# EAGLE design rpi_gnss_board (EAGLE 9.6.2)
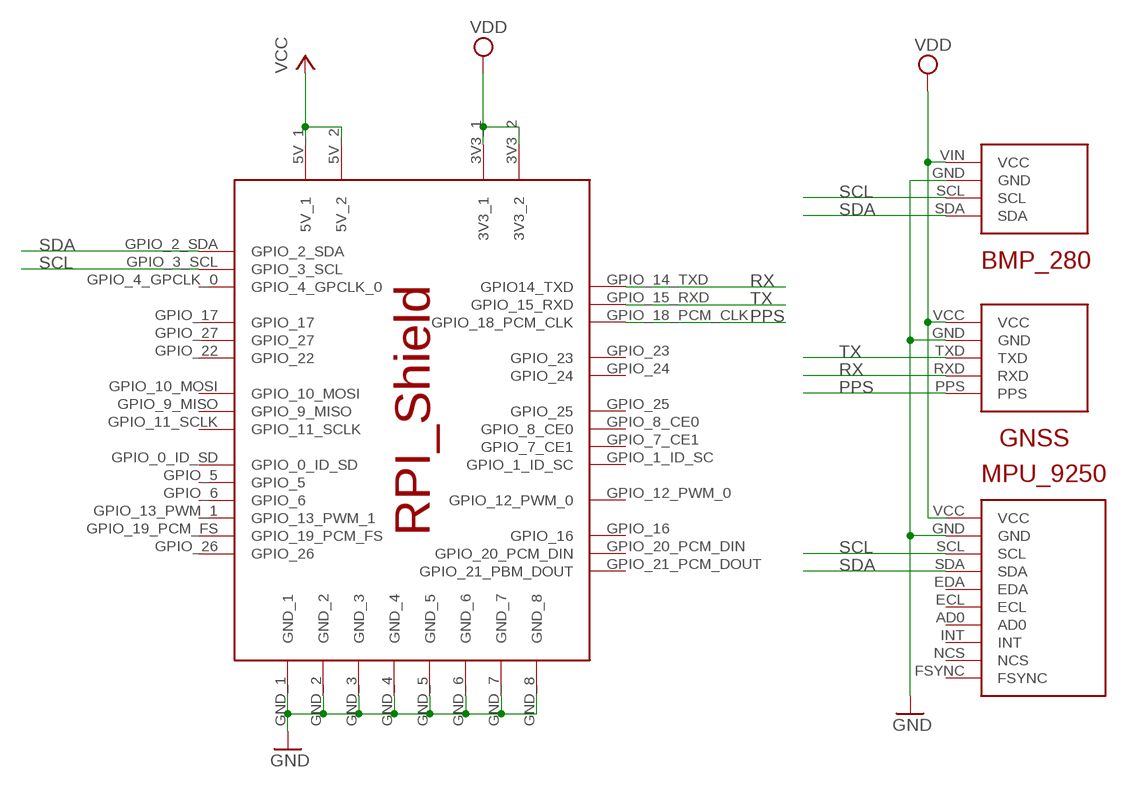
[diagram p0: schematic, sheet 1]

## Parts
U$1  RPI_SHIELD  [RPI_SHIELD]
U$2  BMP_280  [BMP_280]
U$3  GNSS_MODULE_UBLOX  [GNSS_MODULE_UBLOX]
U$4  MPU_9250  [MPU_9250]

## Nets
GND: U$1.GND_1 U$1.GND_2 U$1.GND_3 U$1.GND_4 U$1.GND_5 U$1.GND_6 U$1.GND_7 U$1.GND_8 U$2.GND U$3.GND U$4.GND
PPS: U$1.GPIO_18_PCM_CLK U$3.PPS
RX: U$1.GPIO_14_TXD(GPIO14_TXD) U$3.RXD
SCL: U$1.GPIO_3_SCL U$2.SCL U$4.SCL
SDA: U$1.GPIO_2_SDA U$2.SDA U$4.SDA
TX: U$1.GPIO_15_RXD U$3.TXD
VCC: U$1.5V_1 U$1.5V_2
VDD: U$1.3V3_1 U$1.3V3_2 U$2.VIN(VCC) U$3.VCC U$4.VCC
Unconnected: U$1.GPIO_0_ID_SD U$1.GPIO_1_ID_SC U$1.GPIO_4_GPCLK_0 U$1.GPIO_5 U$1.GPIO_6 U$1.GPIO_7_CE1 U$1.GPIO_8_CE0 U$1.GPIO_9_MISO U$1.GPIO_10_MOSI U$1.GPIO_11_SCLK U$1.GPIO_12_PWM_0 U$1.GPIO_13_PWM_1 U$1.GPIO_16 U$1.GPIO_17 U$1.GPIO_19_PCM_FS U$1.GPIO_20_PCM_DIN U$1.GPIO_21_PCM_DOUT(GPIO_21_PBM_DOUT) U$1.GPIO_22 U$1.GPIO_23 U$1.GPIO_24 U$1.GPIO_25 U$1.GPIO_26 U$1.GPIO_27 U$4.AD0 U$4.ECL U$4.EDA U$4.FSYNC U$4.INT U$4.NCS

## Library data of the parts
U$1 = rpi_shield:RPI_SHIELD
U$2 = bmp_280:BMP_280
U$3 = gnss_modules:GNSS_MODULE_UBLOX
U$4 = MPU_9250_module:MPU_9250

## Board
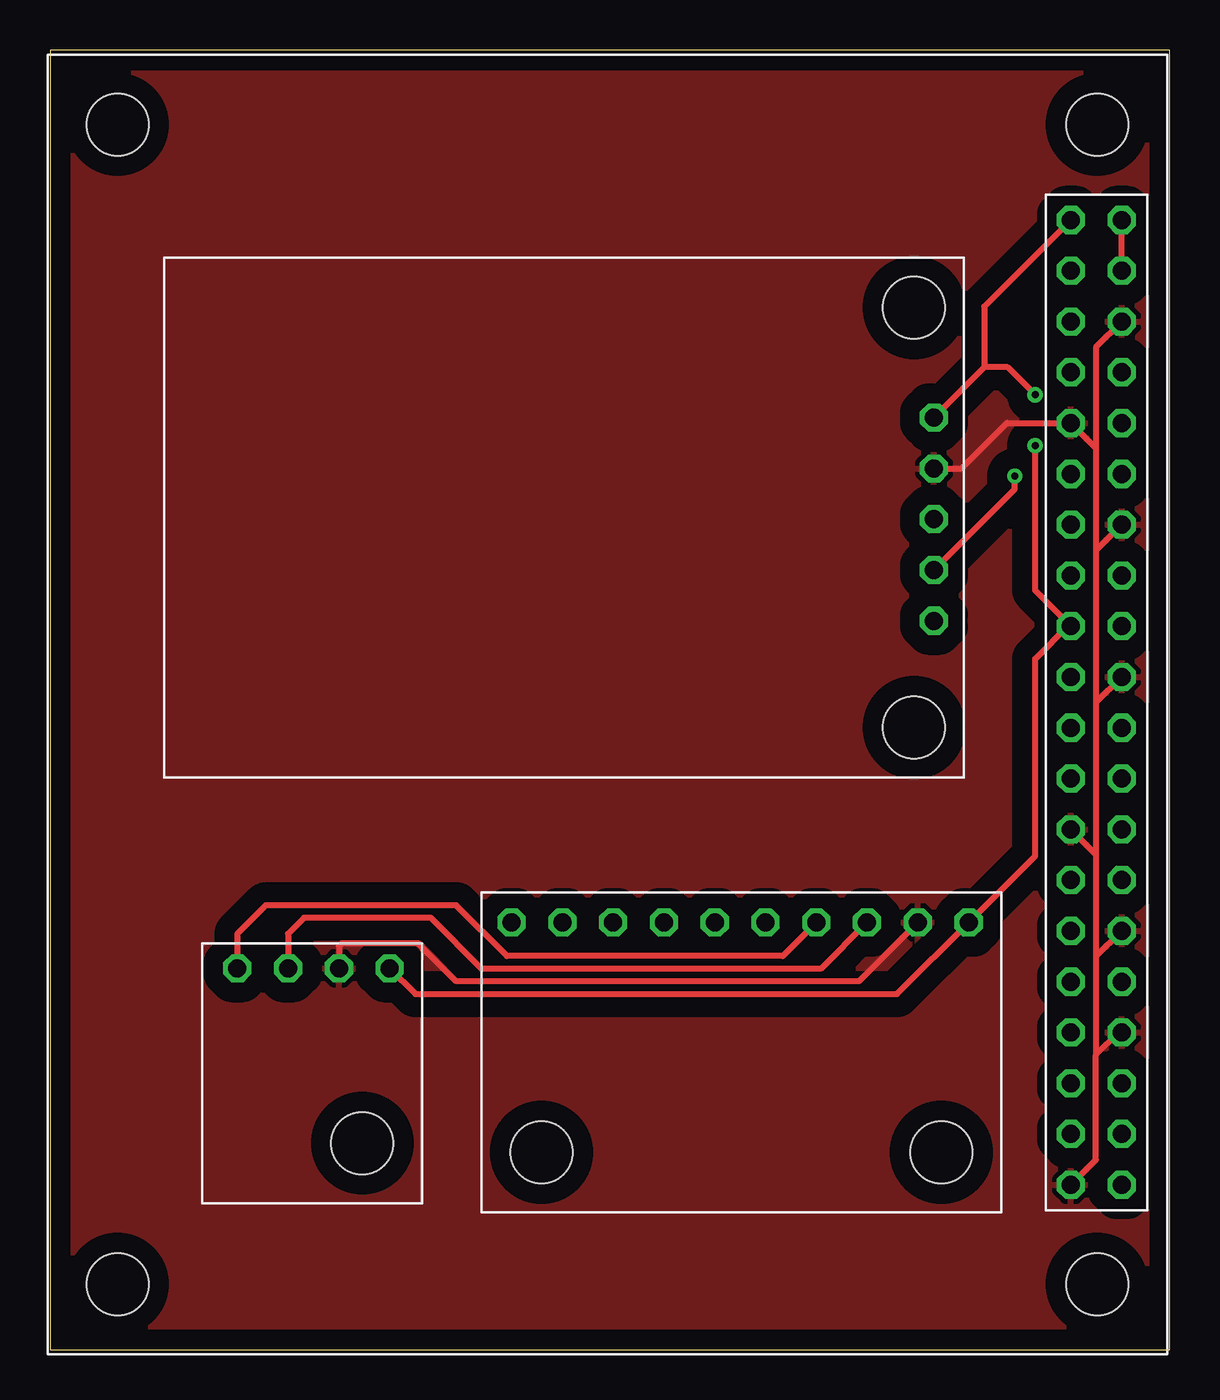
[diagram p1: board, top side]
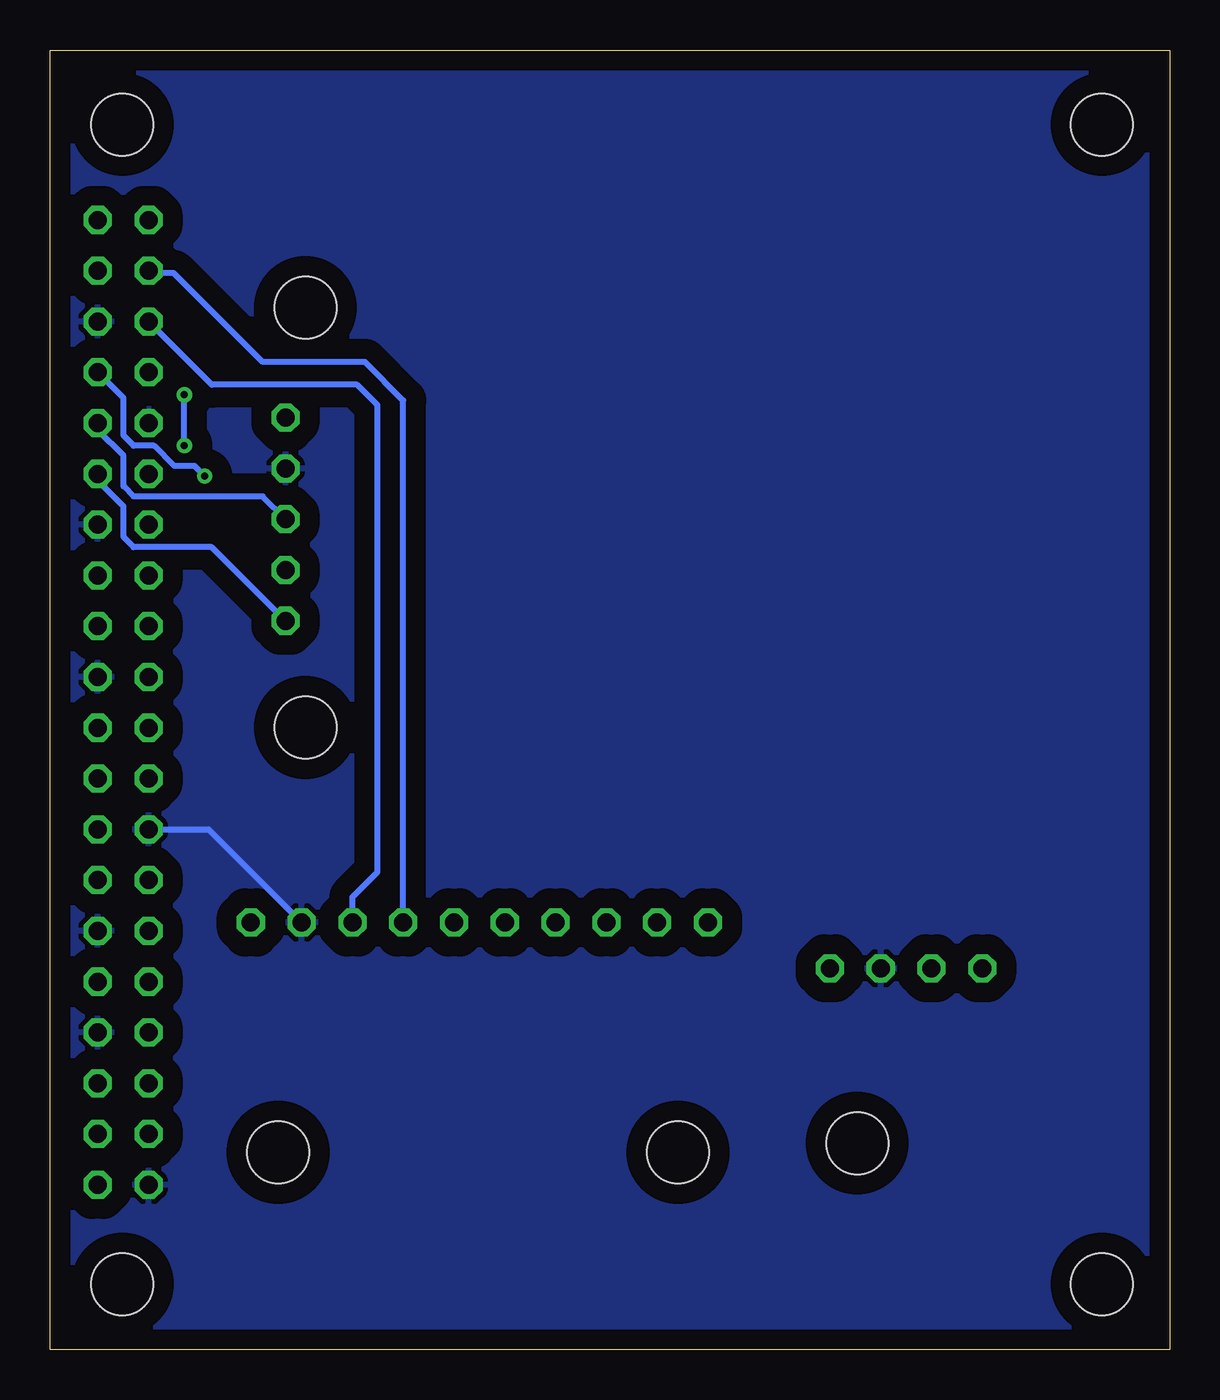
[diagram p2: board, bottom side, seen from below]

Size 56 x 65 mm. Coordinates in mm from the lower left corner, seen from the top.
Outline: 0,0 56,0 56,65 0,65 0,0
Copper layers (1*16): Top 0.035mm / dielectric 1.5mm / Bottom 0.035mm
Design rules "default": minimum track width 6mil, minimum drill 0.35mm, track to track 6mil, track to pad 6mil, pad to pad 6mil, via to via 6mil, smd to smd 6mil, copper to edge 40mil, drill to drill 6mil, minimum pad ring 10mil, minimum via ring 8mil, stop-mask expansion 4mil, vias tented up to drill 0mil, thermal gap 10mil

### Footprints (pad centres in the part's own frame; a part is rotated, then mirrored left to right if it is on the bottom)
RPI_SHIELD = drill 0.9 octagon: 3V3_1 51.07,36.18; 3V3_2 51.07,56.5; 5V_1 53.61,56.5; 5V_2 53.61,53.96; GND_1 53.61,51.42; GND_2 53.61,41.26; GND_3 53.61,33.64; GND_4 53.61,20.94; GND_5 53.61,15.86; GND_6 51.07,8.24; GND_7 51.07,26.02; GND_8 51.07,46.34; GPIO_0_ID_SD 51.07,23.48; GPIO_1_ID_SC 53.61,23.48; GPIO_2_SDA 51.07,53.96; GPIO_3_SCL 51.07,51.42; GPIO_4_GPCLK_0 51.07,48.88; GPIO_5 51.07,20.94; GPIO_6 51.07,18.4; GPIO_7_CE1 53.61,26.02; GPIO_8_CE0 53.61,28.56; GPIO_9_MISO 51.07,31.1; GPIO_10_MOSI 51.07,33.64; GPIO_11_SCLK 51.07,28.56; GPIO_12_PWM_0 53.61,18.4; GPIO_13_PWM_1 51.07,15.86; GPIO_14_TXD 53.61,48.88; GPIO_15_RXD 53.61,46.34; GPIO_16 53.61,13.32; GPIO_17 51.07,43.8; GPIO_18_PCM_CLK 53.61,43.8; GPIO_19_PCM_FS 51.07,13.32; GPIO_20_PCM_DIN 53.61,10.78; GPIO_21_PCM_DOUT 53.61,8.24; GPIO_22 51.07,38.72; GPIO_23 53.61,38.72; GPIO_24 53.61,36.18; GPIO_25 53.61,31.1; GPIO_26 51.07,10.78; GPIO_27 51.07,41.26 | hole 3.1: 52.38,61.27; 3.38,61.27; 3.38,3.27; 52.38,3.27
BMP_280 = drill 0.9 octagon: GND 1.25,6.83; SCL 1.25,4.29; SDA 1.25,1.75; VIN 1.25,9.37 | hole 3.1: 10,8
GNSS_MODULE_UBLOX = drill 0.9 octagon: GND 1.5,10.54; PPS 1.5,18.16; RXD 1.5,15.62; TXD 1.5,13.08; VCC 1.5,8 | hole 3.1: 2.5,23.5; 2.5,2.5
MPU_9250 = drill 0.9 octagon: AD0 1.5,9.12; ECL 1.5,11.66; EDA 1.5,14.2; FSYNC 1.5,1.5; GND 1.5,21.82; INT 1.5,6.58; NCS 1.5,4.04; SCL 1.5,19.28; SDA 1.5,16.74; VCC 1.5,24.36 | hole 3.1: 13,23; 13,3

### Placement (x,y rotation side)
U$1  0,0 0 top
U$2  7.62,20.32 270 top
U$3  45.72,54.61 180 top
U$4  21.59,22.86 270 top

### Tracks (layer width: path | path; a pad name or v marks a point on that pad's centre or on a via)
GND
  Top 0.3: U$4.GND 40.47,18.41 20.32,18.41 18.41,20.32 14.61,20.32 14.45,20.16 U$2.GND | U$1.GND_6 52.32,9.49 52.32,14.73 | 52.32,14.73 53.45,15.86 U$1.GND_5 | U$1.GND_4 52.32,19.65 | 52.32,19.65 52.32,14.73 | U$1.GND_7 52.32,24.77 | 52.32,24.77 52.32,19.65 | U$1.GND_3 52.32,32.35 | 52.32,32.35 52.32,24.77 | U$1.GND_2 52.32,39.97 | 52.32,39.97 52.32,32.35 | 52.32,45.09 U$1.GND_8 47.86,46.34 45.59,44.07 U$3.GND | 52.32,45.09 52.32,39.97 | U$1.GND_1 52.32,50.13 52.32,45.09
  Bottom 0.3: U$1.GND_7 48.07,26.02 U$4.GND
  pour Bottom (isolate 1): 0,0 56,0 56,65 0,65
  pour Top (isolate 1): 0,65 56,65 56,0 0,0
PPS
  Bottom 0.3: U$3.PPS 47.9,40.13 51.82,40.13 52.32,40.64 52.32,42.16 53.61,43.45 U$1.GPIO_18_PCM_CLK
RX  (via drill 0.35)
  Top 0.3: U$3.RXD 48.26,43.03 v48.26,43.69
  Bottom 0.3: v48.26,43.69 48.77,44.2 49.78,44.2 50.8,45.21 51.82,45.21 52.32,45.72 52.32,47.59 U$1.GPIO_14_TXD
SCL
  Top 0.3: U$4.SCL 38.56,19.05 21.59,19.05 19.05,21.59 12.7,21.59 11.91,20.8 U$2.SCL
  Bottom 0.3: U$4.SCL 40.87,22.63 39.62,23.88 39.62,47.24 40.64,48.26 47.91,48.26 U$1.GPIO_3_SCL
SDA
  Top 0.3: U$4.SDA 36.66,19.68 22.86,19.68 20.32,22.23 10.79,22.23 9.37,20.8 U$2.SDA
  Bottom 0.3: U$1.GPIO_2_SDA 50.96,53.85 49.81,53.85 45.36,49.39 40.25,49.39 38.33,47.47 U$4.SDA
TX
  Bottom 0.3: U$3.TXD 45.36,42.67 51.82,42.67 52.32,43.18 52.32,44.7 53.61,45.99 U$1.GPIO_15_RXD
VCC
  Top 0.3: U$1.5V_2 U$1.5V_1
VDD  (via drill 0.35)
  Top 0.3: U$2.VIN 18.28,17.78 42.37,17.78 U$4.VCC 49.28,24.69 49.28,34.54 50.99,36.26 | U$1.3V3_2 46.74,52.17 46.74,49.13 | 46.74,49.13 U$3.VCC | U$1.3V3_1 50.99,36.26 | 50.99,36.26 49.28,37.97 v49.28,45.21 | v49.28,47.75 47.9,49.13 46.74,49.13
  Bottom 0.3: v49.28,45.21 v49.28,47.75